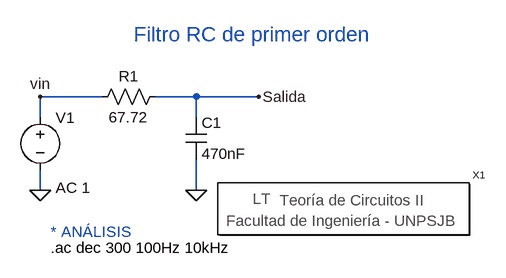
[diagram p0: schematic FiltroRCPrimerOrden.asc]
FiltroRCPrimerOrden.asc, the LTspice schematic file:
Version 4
SHEET 1 880 680
WIRE 64 48 -32 48
WIRE 208 48 144 48
WIRE 304 48 208 48
WIRE -32 80 -32 48
WIRE 208 80 208 48
WIRE -32 192 -32 160
WIRE 208 192 208 144
FLAG 208 192 0
FLAG 304 48 Salida
FLAG -32 48 vin
FLAG -32 192 0
SYMBOL res 160 32 R90
WINDOW 0 0 56 VBottom 2
WINDOW 3 32 56 VTop 2
SYMATTR InstName R1
SYMATTR Value 67.72
SYMBOL cap 192 80 R0
SYMATTR InstName C1
SYMATTR Value 470nF
SYMBOL Circuitos2\\Letreros\\Teoría\ de\ Circuitos\ II 432 224 R0
SYMATTR InstName X1
SYMBOL voltage -32 64 R0
WINDOW 123 24 124 Left 2
WINDOW 39 0 0 Left 0
SYMATTR InstName V1
SYMATTR Value ""
SYMATTR Value2 AC 1
TEXT -16 280 Left 2 !.ac dec 300 100Hz 10kHz
TEXT -16 256 Left 2 ;* ANÁLISIS
TEXT 112 -48 Left 3 ;Filtro RC de primer orden

The netlist it stands for:
* FiltroRCPrimerOrden.asc
R1 Salida vin 67.72
C1 Salida 0 470nF
XX1 Teoría de Circuitos II
V1 vin 0 AC 1
.ac dec 300 100Hz 10kHz
* * ANÁLISIS
* Filtro RC de primer orden
.backanno
.end